# EAGLE design schema_v5_0 (EAGLE 6.5.0)
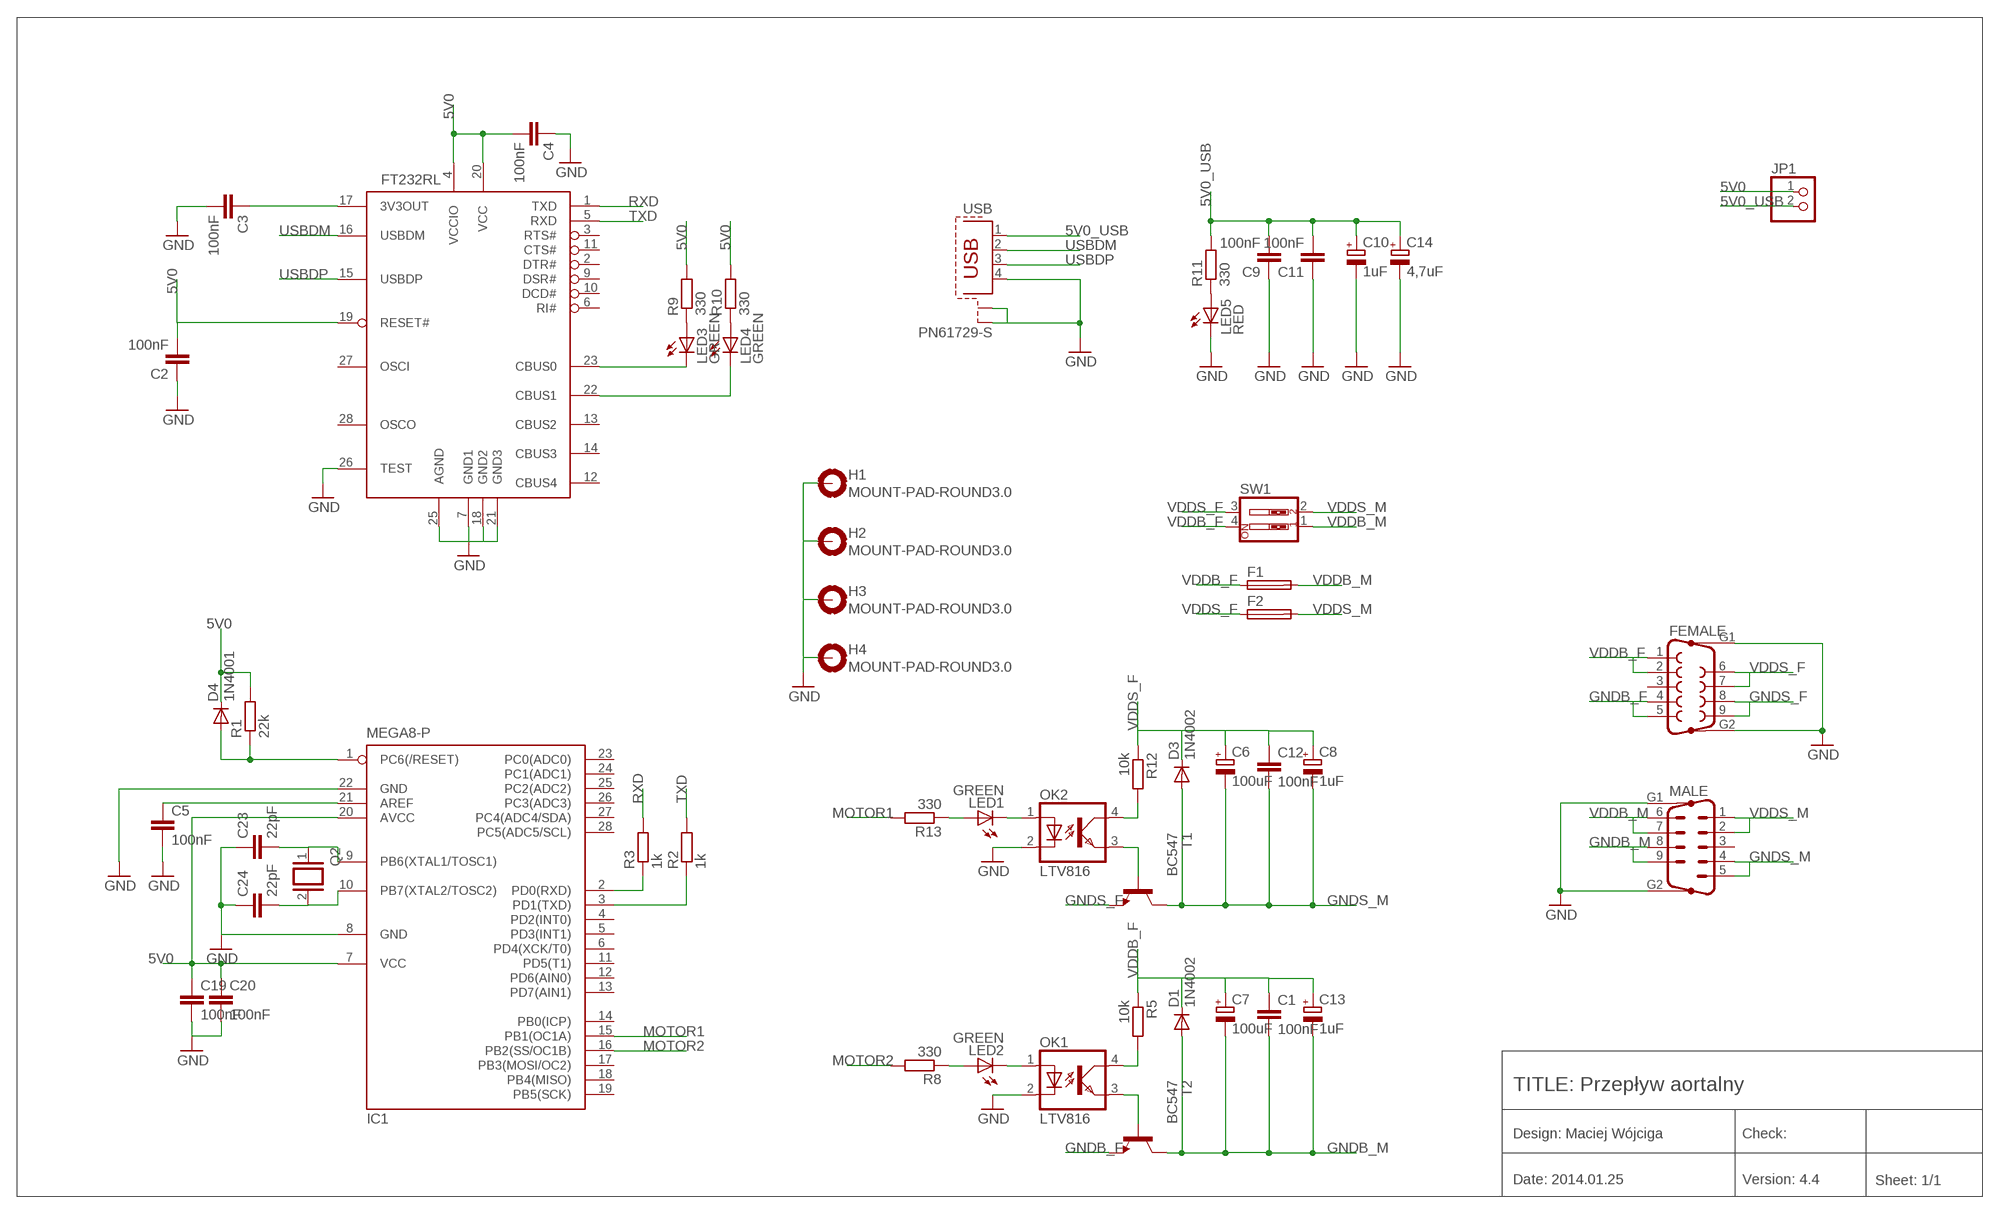
[diagram p0: schematic, sheet 1]

## Parts
C1  100nF  C-EU025-025X050  [C025-025X050]
C2  100nF  C-EU025-025X050  [C025-025X050]
C3  100nF  C-EU025-025X050  [C025-025X050]
C4  100nF  C-EU025-025X050  [C025-025X050]
C5  100nF  C-EU025-025X050  [C025-025X050]
C6  100uF  CPOL-EUE5-13  [E5-13]
C7  100uF  CPOL-EUE5-13  [E5-13]
C8  1uF  CPOL-EUE2-4  [E2-4]
C9  100nF  C-EU025-025X050  [C025-025X050]
C10  1uF  CPOL-EUE2.5-5  [E2,5-5]
C11  100nF  C-EU025-025X050  [C025-025X050]
C12  100nF  C-EU025-025X050  [C025-025X050]
C13  1uF  CPOL-EUE2-4  [E2-4]
C14  4,7uF  CPOL-EUE2.5-5  [E2,5-5]
C19  100nF  C-EU025-025X050  [C025-025X050]
C20  100nF  C-EU025-025X050  [C025-025X050]
C23  22pF  C-EU025-025X050  [C025-025X050]
C24  22pF  C-EU025-025X050  [C025-025X050]
D1  1N4002  1N4004  [DO41-10]
D3  1N4002  1N4004  [DO41-10]
D4  1N4001  1N4004  [DO41-10]
F1  GSH15  [GSH15]
F2  GSH15  [GSH15]
FEMALE  F09HP  [F09HP]
FT232RL  FT232RL  [SSOP28DB]
H1  MOUNT-PAD-ROUND3.0  [3,0-PAD]
H2  MOUNT-PAD-ROUND3.0  [3,0-PAD]
H3  MOUNT-PAD-ROUND3.0  [3,0-PAD]
H4  MOUNT-PAD-ROUND3.0  [3,0-PAD]
IC1  MEGA8-P  [DIL28-3]
JP1  PINHD-1X2  [1X02]
LED1  GREEN  LED3MM  [LED3MM]
LED2  GREEN  LED3MM  [LED3MM]
LED3  GREEN  LED3MM  [LED3MM]
LED4  GREEN  LED3MM  [LED3MM]
LED5  RED  LED3MM  [LED3MM]
MALE  M09HP  [M09HP]
OK1  LTV816  [DIL04]
OK2  LTV816  [DIL04]
Q2  XTAL/S  [QS]
R1  22k  R-EU_0207/10  [0207/10]
R2  1k  R-EU_0207/10  [0207/10]
R3  1k  R-EU_0207/10  [0207/10]
R5  10k  R-EU_0207/10  [0207/10]
R8  330  R-EU_0207/10  [0207/10]
R9  330  R-EU_0207/10  [0207/10]
R10  330  R-EU_0207/10  [0207/10]
R11  330  R-EU_0207/10  [0207/10]
R12  10k  R-EU_0207/10  [0207/10]
R13  330  R-EU_0207/10  [0207/10]
SW1  SW_DIP-2  [EDG-02]
T1  BC547  [TO92]
T2  BC547  [TO92]
USB  PN61729-S  [PN61729-S]

## Nets
5V0: C2.2 C4.2 C19.1 C20.1 D4.C FT232RL.4(VCCIO) FT232RL.19(RESET#) FT232RL.20(VCC) IC1.7(VCC) IC1.20(AVCC) JP1.1 R1.2 R9.2 R10.2
5V0_USB: C9.2 C10.+ C11.2 C14.+ JP1.2 R11.2 USB.1
GND: C2.1 C3.2 C4.1 C5.2 C9.1 C10.- C11.1 C14.- C19.2 C20.2 C23.1 C24.1 FEMALE.G1 FEMALE.G2 FT232RL.7(GND1) FT232RL.18(GND2) FT232RL.21(GND3) FT232RL.25(AGND) FT232RL.26(TEST) H1.B3,0(MOUNT) H2.B3,0(MOUNT) H3.B3,0(MOUNT) H4.B3,0(MOUNT) IC1.8(GND) IC1.22(GND) LED5.K(C) MALE.G1 MALE.G2 OK1.2(C) OK2.2(C) USB.4 USB.S1 USB.S2
GNDB_F: FEMALE.4 FEMALE.5 T2.1(E)
GNDB_M: C1.2 C7.- C13.- D1.A MALE.8 MALE.9 T2.3(C)
GNDS_F: FEMALE.8 FEMALE.9 T1.1(E)
GNDS_M: C6.- C8.- C12.2 D3.A MALE.4 MALE.5 T1.3(C)
MOTOR1: IC1.15(PB1(OC1A)) R13.2
MOTOR2: IC1.16(PB2(SS/OC1B)) R8.2
N$1: IC1.3(PD1(TXD)) R2.1
N$2: IC1.2(PD0(RXD)) R3.1
N$4: LED1.A R13.1
N$5: LED1.K(C) OK2.1(A)
N$6: LED2.A R8.1
N$7: OK2.4(COL) R12.2
N$8: LED3.A R9.1
N$9: LED4.A R10.1
N$10: LED5.A R11.1
N$11: OK1.4(COL) R5.2
N$12: LED2.K(C) OK1.1(A)
N$13: OK1.3(EMIT) T2.2(B)
N$15: OK2.3(EMIT) T1.2(B)
N$26: C5.1 IC1.21(AREF)
N$29: C23.2 IC1.9(PB6(XTAL1/TOSC1)) Q2.1
N$35: C24.2 IC1.10(PB7(XTAL2/TOSC2)) Q2.2
N$41: FT232RL.23(CBUS0) LED3.K(C)
N$42: FT232RL.22(CBUS1) LED4.K(C)
N$96: C3.1 FT232RL.17(3V3OUT)
RESET: D4.A IC1.1(PC6(/RESET)) R1.1
RXD: FT232RL.1(TXD) R3.2
TXD: FT232RL.5(RXD) R2.2
USBDM: FT232RL.16(USBDM) USB.2
USBDP: FT232RL.15(USBDP) USB.3
VDDB_F: C1.1 C7.+ C13.+ D1.C F1.1 FEMALE.1 FEMALE.2 R5.1 SW1.4
VDDB_M: F1.2 MALE.6 MALE.7 SW1.1
VDDS_F: C6.+ C8.+ C12.1 D3.C F2.1 FEMALE.6 FEMALE.7 R12.1 SW1.3
VDDS_M: F2.2 MALE.1 MALE.2 SW1.2
Unconnected: FEMALE.3 FT232RL.2(DTR#) FT232RL.3(RTS#) FT232RL.6(RI#) FT232RL.9(DSR#) FT232RL.10(DCD#) FT232RL.11(CTS#) FT232RL.12(CBUS4) FT232RL.13(CBUS2) FT232RL.14(CBUS3) FT232RL.27(OSCI) FT232RL.28(OSCO) IC1.4(PD2(INT0)) IC1.5(PD3(INT1)) IC1.6(PD4(XCK/T0)) IC1.11(PD5(T1)) IC1.12(PD6(AIN0)) IC1.13(PD7(AIN1)) IC1.14(PB0(ICP)) IC1.17(PB3(MOSI/OC2)) IC1.18(PB4(MISO)) IC1.19(PB5(SCK)) IC1.23(PC0(ADC0)) IC1.24(PC1(ADC1)) IC1.25(PC2(ADC2)) IC1.26(PC3(ADC3)) IC1.27(PC4(ADC4/SDA)) IC1.28(PC5(ADC5/SCL)) MALE.3

## Notes on the sheet
- TITLE: Przepływ aortalny
- Design: Maciej Wójciga | Check:
- Date: 2014.01.25 | Version: 4.4 | Sheet: 1/1

## Library data of the parts
C1-C5 C9 C11 C12 C19 C20 C23 C24 = rcl:C-EU: CAPACITOR, European symbol
C6-C8 C10 C13 C14 = rcl:CPOL-EU: POLARIZED CAPACITOR, European symbol
D1 D3 D4 = diode:1N4004: DIODE general purpose rectifier, 1 A
F1 F2 = fuse:GSH15: FUSE HOLDER grid 15mm, 19649 Wickmann; MPN: 64900001039; OC_FARNELL: 1271673; OC_NEWARK: 02P0318
FEMALE = con-subd:F09HP: SUB-D; OC_FARNELL: unknown; OC_NEWARK: unknown
FT232RL = ftdichip-5:FT232RL: USB UART 4th Generation USB UART (USB <-> Serial) Controller
H1-H4 = holes:MOUNT-PAD-ROUND: MOUNTING PAD, round
IC1 = atmel:MEGA8-P: MICROCONTROLLER 8 Kbytes FLASH, 1 kbytes SRAM, 512 bytes EEPROM, USART, 4-channel 10 bit ADC, 2-channel 8 bit ADC Pin compatible with Atmega48, ATMega88, ATMega168 Source: avr.lbr; OC_FARNELL: unknown; OC_NEWARK: unknown
JP1 = pinhead:PINHD-1X2: PIN HEADER
LED1-LED5 = led:LED: LED OSRAM: - CHIPLED LG R971, LG N971, LY N971, LG Q971, LY Q971, LO R971, LY R971 LH N974, LH R974 LS Q976, LO Q976, LY Q976 LO Q996 - Hyper CHIPLED LW Q18S LB Q993, LB Q99A, LB R99A - SideLED LS A670, LO A670, LY A670, LG A670, LP A670 LB A673, LV A673, LT A673, LW A673 LH A674 LY A675 LS A676, LA A676, LO A676, LY A676, LW A676 LS A679, LY A679, LG A679 - Hyper Micro SIDELED® LS Y876, LA Y876, LO Y876, LY Y876 LT Y87S - SmartLED LW L88C, LW L88S LB L89C, LB L89S, LG L890 LS L89K, LO L89K, LY L89K LS L896, LA L896, LO L896, LY L896 - TOPLED LS T670, LO T670, LY T670, LG T670, LP T670 LSG T670, LSP T670, LSY T670, LOP T670, LYG T670 LG T671, LOG T671, LSG T671 LB T673, LV T673, LT T673, LW T673 LH T674 LS T676, LA T676, LO T676, LY T676, LB T676, LH T676, LSB T676, LW T676 LB T67C, LV T67C, LT T67C, LS T67K, LO T67K, LY T67K, LW E67C LS E67B, LA E67B, LO E67B, LY E67B, LB E67C, LV E67C, LT E67C LW T67C LS T679, LY T679, LG T679 LS T770, LO T770, LY T770, LG T770, LP T770 LB T773, LV T773, LT T773, LW T773 LH T774 LS E675, LA E675, LY E675, LS T675 LS T776, LA T776, LO T776, LY T776, LB T776 LHGB T686 LT T68C, LB T68C - Hyper Mini TOPLED® LB M676 - Mini TOPLED Santana® LG M470 LS M47K, LO M47K, LY M47K Source: http://www.osram.convergy.de LUXEON: - LUMILED® LXK2-PW12-R00, LXK2-PW12-S00, LXK2-PW14-U00, LXK2-PW14-V00 LXK2-PM12-R00, LXK2-PM12-S00, LXK2-PM14-U00 LXK2-PE12-Q00, LXK2-PE12-R00, LXK2-PE12-S00, LXK2-PE14-T00, LXK2-PE14-U00 LXK2-PB12-K00, LXK2-PB12-L00, LXK2-PB12-M00, LXK2-PB14-N00, LXK2-PB14-P00, LXK2-PB14-Q00 LXK2-PR12-L00, LXK2-PR12-M00, LXK2-PR14-Q00, LXK2-PR14-R00 LXK2-PD12-Q00, LXK2-PD12-R00, LXK2-PD12-S00 LXK2-PH12-R00, LXK2-PH12-S00 LXK2-PL12-P00, LXK2-PL12-Q00, LXK2-PL12-R00 Source: www.luxeon.com KINGBRIGHT: KA-3528ASYC Source: www.kingbright.com
MALE = con-subd:M09HP: SUB-D; OC_FARNELL: unknown; OC_NEWARK: unknown
OK1 OK2 = optocoupler:LTV816: OPTO COUPLER Source: LITEON, LTV816.pdf; OC_FARNELL: unknown; OC_NEWARK: unknown
Q2 = special:XTAL/S: CRYSTAL
R1-R3 R5 R8-R13 = rcl:R-EU_: RESISTOR, European symbol
SW1 = special:SW_DIP-2: DIP SWITCH
T1 T2 = transistor:BC547: NPN TRANSISTOR
USB = con-berg:PN61729-S: BERG USB connector; OC_FARNELL: unknown; OC_NEWARK: unknown

## Net classes
0 default: width 0.203 mm

## Board
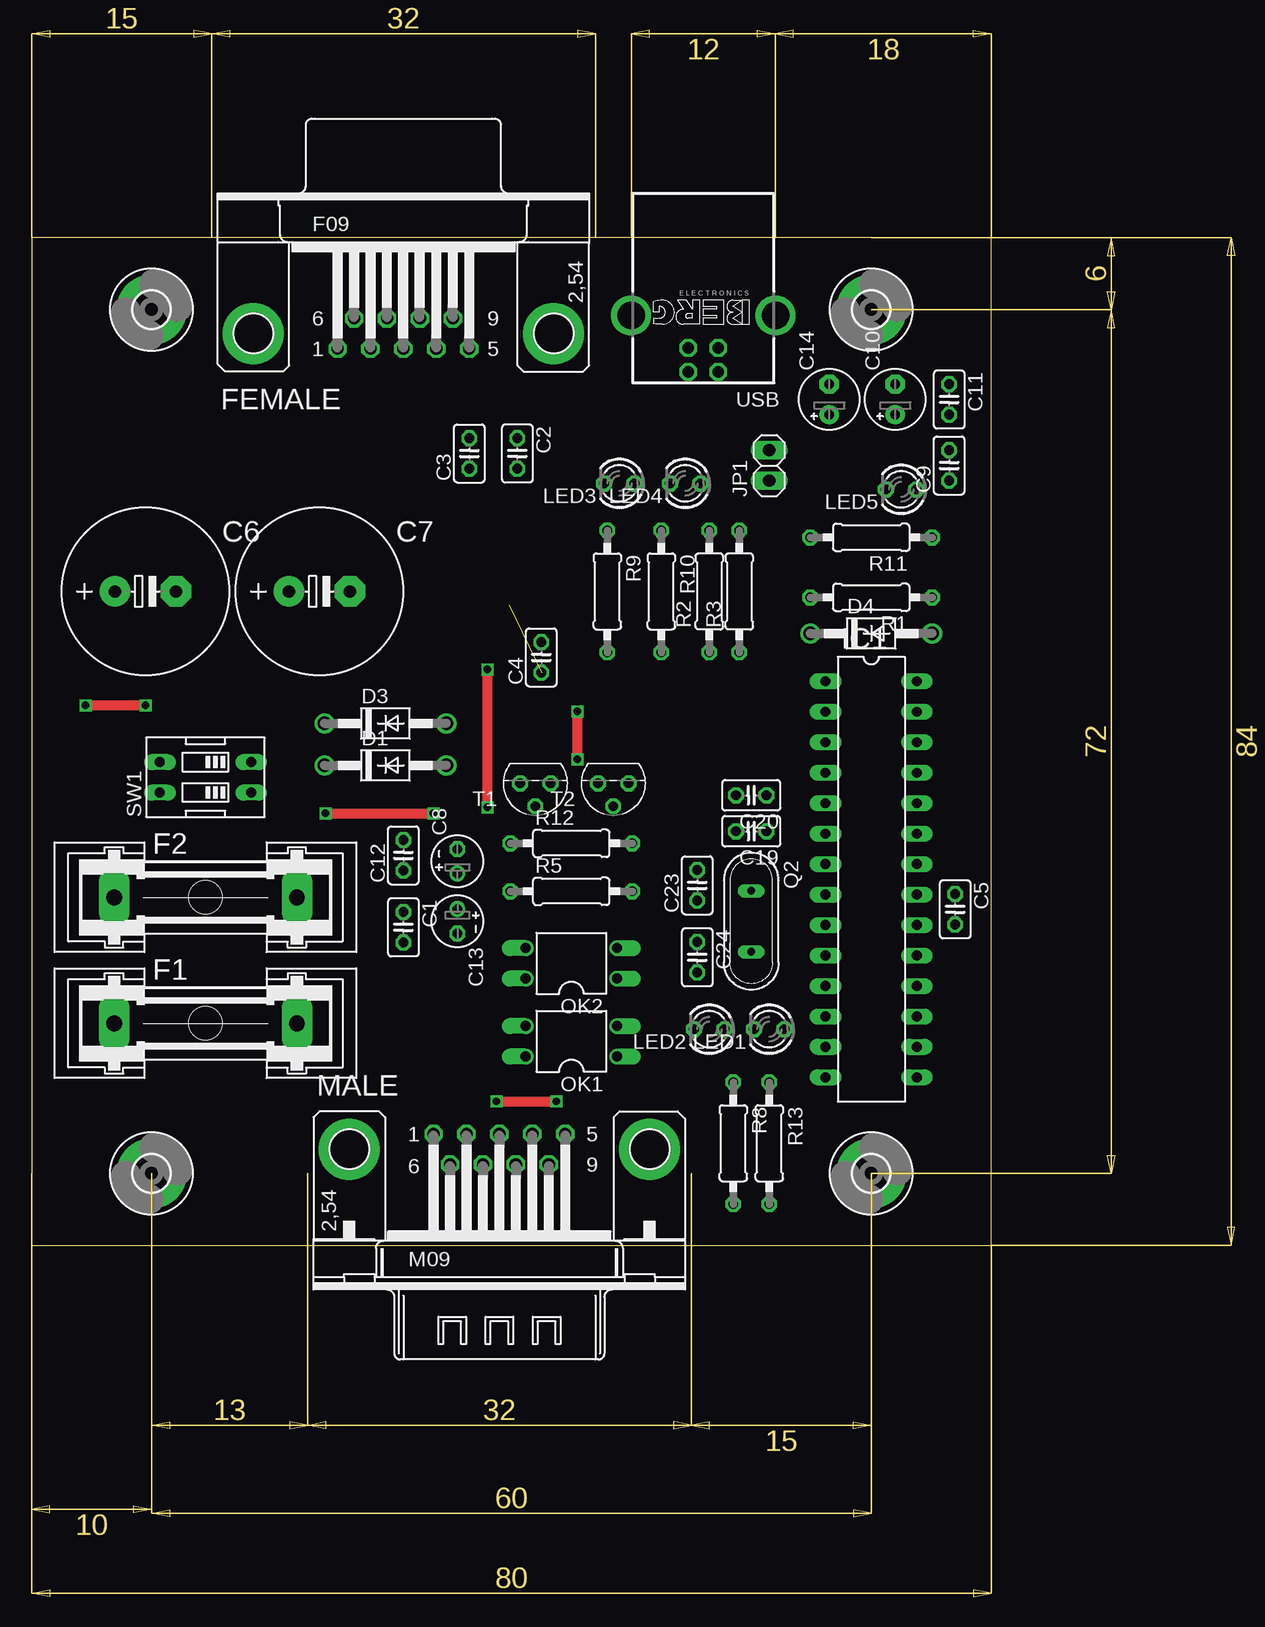
[diagram p1: board, top side]
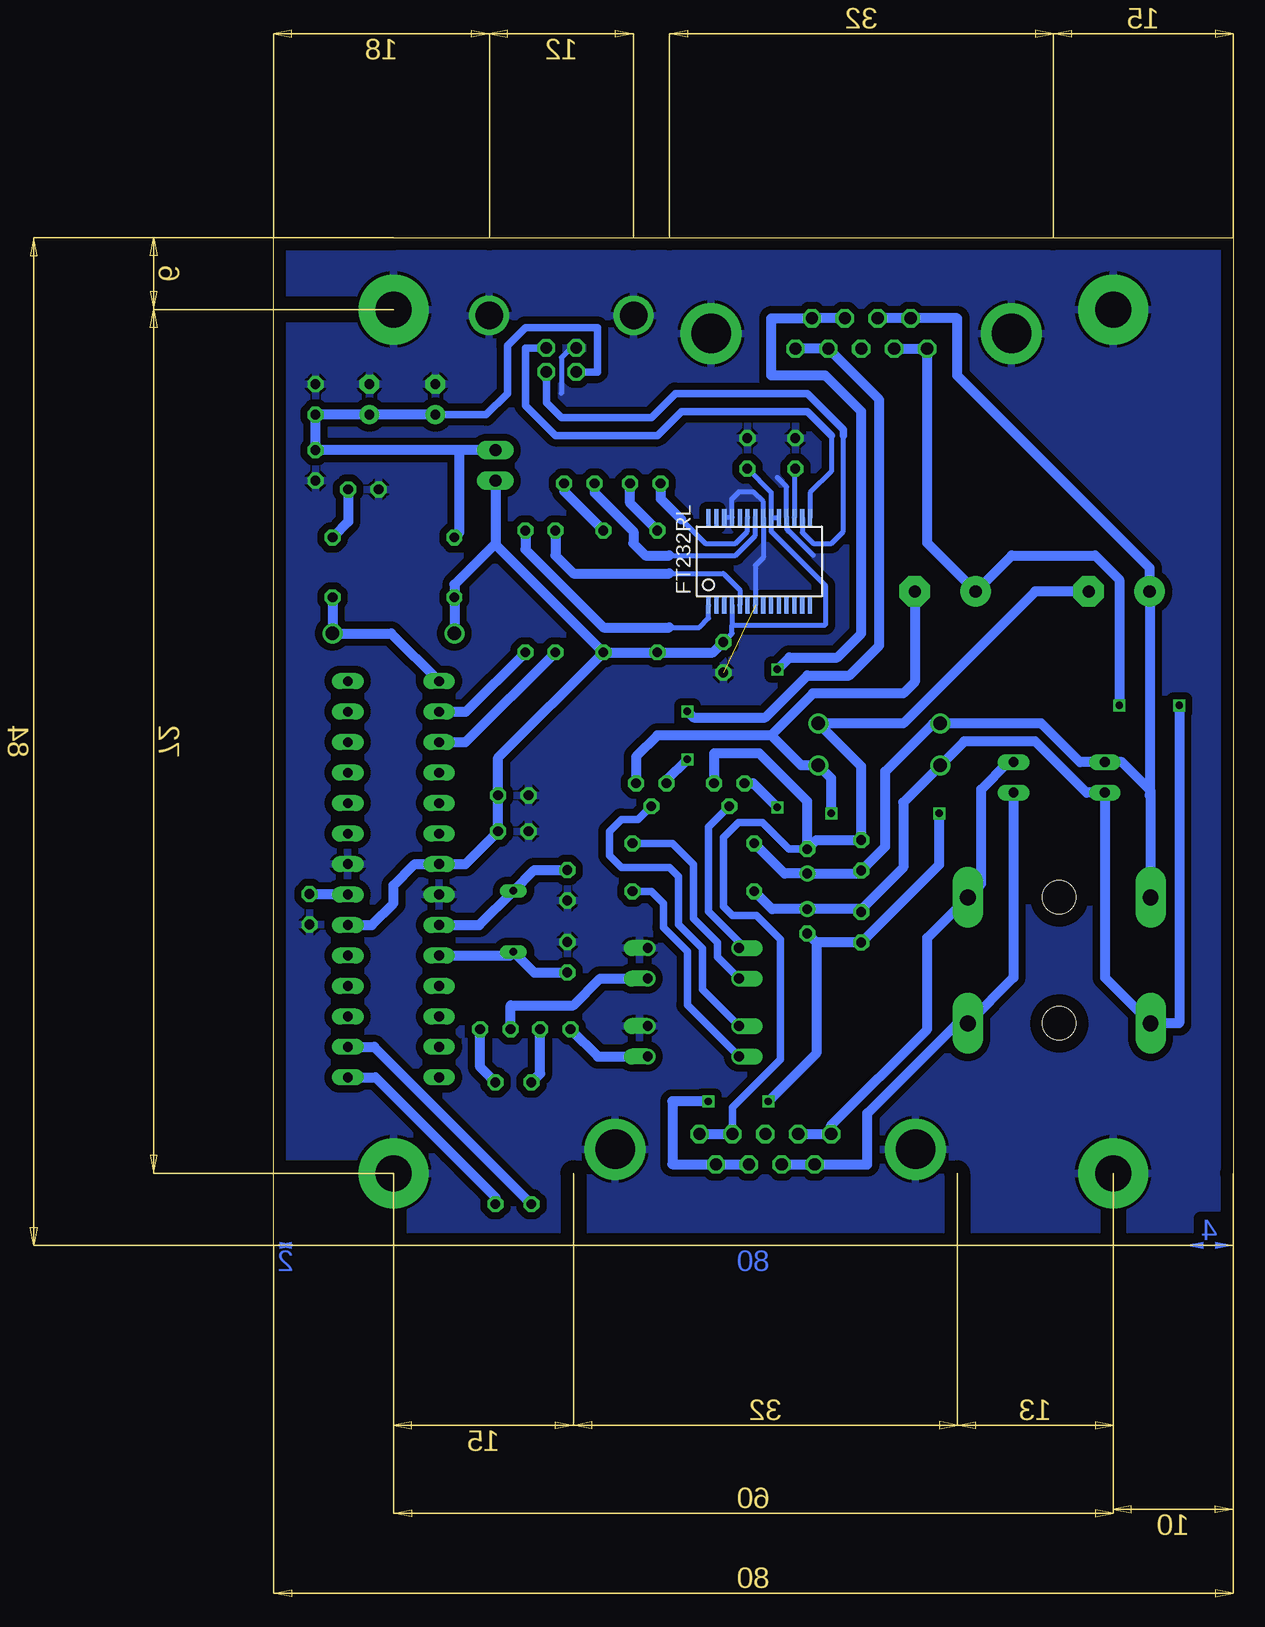
[diagram p2: board, bottom side, seen from below]

Size 80 x 84 mm. Coordinates in mm from the lower left corner, seen from the top.
Outline: 0,0 80,0 80,84 0,84 0,0
Copper layers (1*16): Top 0.035mm / dielectric 1.5mm / Bottom 0.035mm
Design rules "default": minimum track width 10mil, minimum drill 24mil, track to track 8mil, track to pad 8mil, pad to pad 8mil, via to via 8mil, smd to smd 8mil, copper to edge 40mil, drill to drill 8mil, minimum pad ring 10mil, minimum via ring 8mil, stop-mask expansion 4mil, vias tented up to drill 0mil, thermal gap 10mil

### Footprints (pad centres in the part's own frame; a part is rotated, then mirrored left to right if it is on the bottom)
C025-025X050 = drill 0.813 octagon: 1 -1.27,0; 2 1.27,0
E5-13 = drill 1.016 pad 2.54: + -2.54,0 | drill 1.016 pad 2.54 octagon: - 2.54,0
E2-4 = drill 0.813 pad 1.27: + -1.016,0 | drill 0.813 pad 1.27 octagon: - 1.016,0
E2,5-5 = drill 0.813 pad 1.6: + -1.27,0 | drill 0.813 pad 1.6 octagon: - 1.27,0
DO41-10 = drill 1.118: A 5.08,0; C -5.08,0
GSH15 = drill 1.321 pad 2.54 long: 1 -7.62,0; 2 7.62,0 | hole 2.794: 0,0
F09HP = drill 1.016 octagon: 1 -5.486,-1.27; 2 -2.743,-1.27; 3 0,-1.27; 4 2.743,-1.27; 5 5.486,-1.27; 6 -4.115,1.27; 7 -1.372,1.27; 8 1.372,1.27; 9 4.115,1.27 | drill 3.302 pad 5.08: G1 -12.522,0; G2 12.522,0
SSOP28DB = smd 0.348 x 1.397: 1 -4.225,-3.656; 2 -3.575,-3.656; 3 -2.925,-3.656; 4 -2.275,-3.656; 5 -1.625,-3.656; 6 -0.975,-3.656; 7 -0.325,-3.656; 8 0.325,-3.656; 9 0.975,-3.656; 10 1.625,-3.656; 11 2.275,-3.656; 12 2.925,-3.656; 13 3.575,-3.656; 14 4.225,-3.656; 15 4.225,3.656; 16 3.575,3.656; 17 2.925,3.656; 18 2.275,3.656; 19 1.625,3.656; 20 0.975,3.656; 21 0.325,3.656; 22 -0.325,3.656; 23 -0.975,3.656; 24 -1.625,3.656; 25 -2.275,3.656; 26 -2.925,3.656; 27 -3.575,3.656; 28 -4.225,3.656
3,0-PAD = drill 3 pad 5.842: B3,0 0,0
DIL28-3 = drill 0.813 long: 1 -16.51,-3.81; 2 -13.97,-3.81; 3 -11.43,-3.81; 4 -8.89,-3.81; 5 -6.35,-3.81; 6 -3.81,-3.81; 7 -1.27,-3.81; 8 1.27,-3.81; 9 3.81,-3.81; 10 6.35,-3.81; 11 8.89,-3.81; 12 11.43,-3.81; 13 13.97,-3.81; 14 16.51,-3.81; 15 16.51,3.81; 16 13.97,3.81; 17 11.43,3.81; 18 8.89,3.81; 19 6.35,3.81; 20 3.81,3.81; 21 1.27,3.81; 22 -1.27,3.81; 23 -3.81,3.81; 24 -6.35,3.81; 25 -8.89,3.81; 26 -11.43,3.81; 27 -13.97,3.81; 28 -16.51,3.81
1X02 = drill 1.016 long: 1 -1.27,0; 2 1.27,0
LED3MM = drill 0.813 octagon: A -1.27,0; K 1.27,0
M09HP = drill 1.016 octagon: 1 -5.486,1.27; 2 -2.743,1.27; 3 0,1.27; 4 2.743,1.27; 5 5.486,1.27; 6 -4.115,-1.27; 7 -1.372,-1.27; 8 1.372,-1.27; 9 4.115,-1.27 | drill 3.302 pad 5.08: G1 -12.522,0; G2 12.522,0
DIL04 = drill 0.813 offset: 1 -1.27,-3.81; 2 1.27,-3.81; 3 1.27,3.81; 4 -1.27,3.81
QS = drill 0.61 long: 1 -2.54,0; 2 2.54,0
0207/10 = drill 0.813 octagon: 1 -5.08,0; 2 5.08,0
EDG-02 = drill 0.813 long: 1 -1.27,-3.81; 2 1.27,-3.81; 3 1.27,3.81; 4 -1.27,3.81
TO92 = drill 0.813 octagon: 1 1.27,0; 2 0,1.905; 3 -1.27,0
PN61729-S = drill 0.95 octagon: 1 1.25,4.71; 2 -1.25,4.71; 3 -1.25,2.71; 4 1.25,2.71 | drill 2.3 pad 2.9: S1 -6.02,0; S2 6.02,0

### Placement (x,y rotation side)
C1  31,26.5 270 top
C2  40.5,66 270 top
C3  36.5,66 90 top
C4  42.5,49 90 top
C5  77,28 270 top
C6  9.5,54.5 0 top
C7  24,54.5 0 top
C8  35.5,32 90 top
C9  76.5,65 90 top
C10  72,70.5 90 top
C11  76.5,70.5 270 top
C12  31,32.5 90 top
C13  35.5,27 270 top
C14  66.5,70.5 90 top
C19  60,34.5 180 top
C20  60,37.5 180 top
C23  55.5,30 90 top
C24  55.5,24 270 top
D1  29.5,40 0 top
D3  29.5,43.5 0 top
D4  70,51 0 top
F1  14.5,18.5 0 top
F2  14.5,29 0 top
FEMALE  31,76 0 top
FT232RL  39.5,57 0 bottom
H1  10,78 0 top
H2  70,78 0 top
H3  70,6 0 top
H4  10,6 0 top
IC1  70,30.5 270 top
JP1  61.5,65 90 top
LED1  61.5,18 180 top
LED2  56.5,18 180 top
LED3  49,63.5 180 top
LED4  54.5,63.5 180 top
LED5  72.5,63 180 top
MALE  39,8 0 top
OK1  45,17 90 top
OK2  45,23.5 90 top
Q2  60,27 270 top
R1  70,54 180 top
R2  56.5,54.5 90 top
R3  59,54.5 90 top
R5  45,29.5 0 top
R8  58.5,8.5 270 top
R9  48,54.5 270 top
R10  52.5,54.5 270 top
R11  70,59 180 top
R12  45,33.5 0 top
R13  61.5,8.5 270 top
SW1  14.5,39 90 top
T1  42,38.5 180 top
T2  48.5,38.5 180 top
USB  56,77.5 180 top

### Tracks (layer width: path | path; a pad name or v marks a point on that pad's centre or on a via)
5V0
  Bottom 0.406: C4.2 41.77,50.99 41.77,51.7 | FT232RL.20 FT232RL.19 | C2.2 38.52,62.76 FT232RL.20 | FT232RL.20 38.52,59.52 34,55 34,51.7 41.77,51.7 | FT232RL.4 41.77,51.7
  Bottom 0.813: JP1.1 61.5,58.5 | 61.5,58.5 64.92,55.08 R1.2 D4.C | IC1.20 71.81,26.69 70,28.5 70,30 68.23,31.77 IC1.7 64,31.77 C19.1 C20.1 61.27,40.65 R10.2 | R10.2 61.5,58.42 61.5,58.5 | R10.2 R9.2 43.35,49.42 C4.2
5V0_USB
  Bottom 0.61: USB.1 53,72.79 53,76.5 59,76.5 60.5,75 60.5,71 62.27,69.23 C14.+
  Bottom 0.813: C14.+ C10.+ C11.2 C9.2 64.5,66.27 | JP1.2 64.5,66.27 | R11.2 64.5,59.42 64.5,66.27
GND  (1 unrouted)
  Bottom 0.406: 38,64 37.23,63.23 FT232RL.18 37.23,59.73 35,57.5 | FT232RL.7 39.83,56.67 39.17,57.33 FT232RL.21 39.17,61.98 40,62.8 41.2,62.8 41.8,62.2 FT232RL.25 FT232RL.26 | USB.4 55.21,74.79 56,74 56,71
  pour Bottom (isolate 0.61): 0,84 80,84 80,0 0,0
GNDB_F  (via drill 0.6)
  Top 0.813: v45.5,40.5 v45.5,44.5
  Bottom 0.813: FEMALE.5 FEMALE.4 29.5,70.49 29.5,50 32,47.5 35.5,47.5 39,44 45,44 v45.5,44.5 | T2.1 47.23,38.77 v45.5,40.5
GNDB_M  (via drill 0.6)
  Top 0.813: v24.5,36 v33.5,36 | v38.75,12 v43.75,12
  Bottom 0.813: MALE.8 MALE.9 43.12,6.75 46.75,6.75 46.75,12 v43.75,12 | 38.5,42.5 36,40 D1.A 33.5,38.92 v33.5,36 | 38.5,42.5 48,42.5 49.77,40.73 T2.3 | 38.5,42.5 38.5,42.54 35.04,46 27.5,46 26.54,46.96 C7.- | v24.5,36 24.5,31.73 C1.2 34.75,25.23 | 34.75,25.23 C13.- | 34.75,25.23 34.75,16 v38.75,12
GNDS_F  (via drill 0.6)
  Top 0.813: v38,36.5 v38,48
  Bottom 0.813: FEMALE.8 FEMALE.9 38.5,77.27 38.5,72.5 34,72.5 31,69.5 31,51 33,49 37,49 v38,48 | T1.1 40,38.5 v38,36.5
GNDS_M
  Bottom 0.61: C8.- 37.02,33.02 39.25,35.25 41.25,35.25 42.5,34 42.5,28.25 41.75,27.5 39.75,27.5 37.75,25.5 37.75,15.5 41.74,11.51 MALE.4
  Bottom 0.813: MALE.5 MALE.4 | C6.- 16.5,54.5 27.5,43.5 D3.A 31,39.92 C12.2 34.75,33.77 C8.- 35.5,37 39.5,41 43.27,41 T1.3
MOTOR1
  Bottom 0.813: IC1.15 71.49,13.99 61.5,4 R13.2
MOTOR2
  Bottom 0.813: IC1.16 71.61,16.53 R8.2
N$1
  Bottom 0.813: IC1.3 63.99,41.93 R2.1
N$2
  Bottom 0.813: IC1.2 63.95,44.47 R3.1
N$4
  Bottom 0.813: R13.1 62.77,14.85 LED1.A
N$5
  Bottom 0.813: LED1.K 60.23,20 55,20 52.77,22.23 OK2.1
N$6
  Bottom 0.813: R8.1 57.77,14.31 LED2.A
N$7
  Bottom 0.61: R12.2 46.75,33.5 45,31.75 45,27.25 43,25.25 43,24.04 OK2.4
N$8
  Bottom 0.813: R9.1 50.27,61.85 LED3.A
N$9
  Bottom 0.813: LED4.A 55.77,62.85 R10.1
N$10
  Bottom 0.813: LED5.A 73.77,60.31 R11.1
N$11
  Bottom 0.61: R5.2 48.5,29.5 47.5,28.5 47.5,26.5 45.5,24.5 45.5,20.04 OK1.4
N$12
  Bottom 0.813: LED2.K 52.96,15.73 OK1.1
N$13
  Bottom 0.61: 48.25,36.34 T2.2 49.59,35.5 51,35.5 52,34.5 52,32.5 51,31.5 47,31.5 46.25,30.75 46.25,26.75 44.25,24.75 44.25,21.33 OK1.3
N$15
  Bottom 0.61: T1.2 43.75,34.84 43.75,27.83 41.19,25.27 OK2.3
N$26
  Bottom 0.813: IC1.21 76.96,29.23 C5.1
N$29
  Bottom 0.813: IC1.9 62.85,26.69 Q2.1 58.27,31.27 C23.2
N$35
  Bottom 0.813: IC1.10 60.31,24.15 Q2.2 58.27,22.73 C24.2
N$41
  Bottom 0.406: 46,60.5 44,58.5 41.5,58.5 40.5,59.5 40.5,60.63 FT232RL.23
  Bottom 0.813: LED3.K 47.73,62.23 46,60.5
N$42
  Bottom 0.406: 47,57.5 41.5,57.5 39.83,59.17 FT232RL.22
  Bottom 0.813: 47,57.5 49,57.5 50,58.5 50,59.5 53.23,62.73 LED4.K
N$96
  Bottom 0.406: C3.1 36.58,64.66 FT232RL.17
RESET
  Bottom 0.813: R1.1 D4.A 70.18,51 IC1.1
RXD
  Bottom 0.406: 47,51.5 44.5,51.5 43.73,52.27 FT232RL.1
  Bottom 0.813: R3.2 59,58 52.5,51.5 47,51.5
TXD
  Bottom 0.406: 47,56 42.5,56 41.12,54.62 FT232RL.5
  Bottom 0.813: R2.2 56.5,57.5 55,56 47,56
USBDM
  Bottom 0.406: FT232RL.16 35.92,59.42 35,58.5 33.5,58.5 32.5,59.5 32.5,67.5
  Bottom 0.61: 32.5,67.5 32.5,68 35.5,71 46.5,71 48.5,69 56,69 57.25,70.25 USB.2
USBDP
  Bottom 0.406: 33.5,67.5 33.5,64.5 35.27,62.73 FT232RL.15
  Bottom 0.61: 33.5,67.5 35.5,69.5 46,69.5 48,67.5 56.5,67.5 59,70 59,74.79 USB.3
VDDB_F  (via drill 0.6)
  Top 0.813: v9.5,45 v4.5,45
  Bottom 0.813: FEMALE.2 FEMALE.1 25.51,58.55 C7.+ 18.46,57.5 11.5,57.5 9.5,55.5 v9.5,45 | R5.1 38.44,28.02 C13.+ 31.25,28.02 C1.1 31,28 27.5,31.5 27.5,36.92 D1.C 22.42,42 16.5,42 12.23,37.73 SW1.4 10.69,22.31 F1.1 4.5,18.5 v4.5,45
VDDB_M
  Bottom 0.813: MALE.7 MALE.6 30.5,6.73 30.5,11 23,18.5 F1.2 18.31,22.31 SW1.1
VDDS_F
  Bottom 0.813: FEMALE.7 FEMALE.6 23,77.27 23,72.5 6.96,56.46 C6.+ 6.96,37.5 6.88,37.5 | R12.1 37.4,30.98 C8.+ 31.25,30.98 C12.1 29,33.23 29,39.5 25,43.5 D3.C 16,43.5 12.77,40.27 SW1.3 9.27,40.27 6.88,37.88 6.88,37.5 | F2.1 6.88,37.5
VDDS_M
  Bottom 0.813: MALE.2 MALE.1 33.51,9.99 25.5,18 25.5,25.62 F2.2 21,30.12 21,38 18.73,40.27 SW1.2
(copper drawn outside any net)
  shapes: Bottom area x3